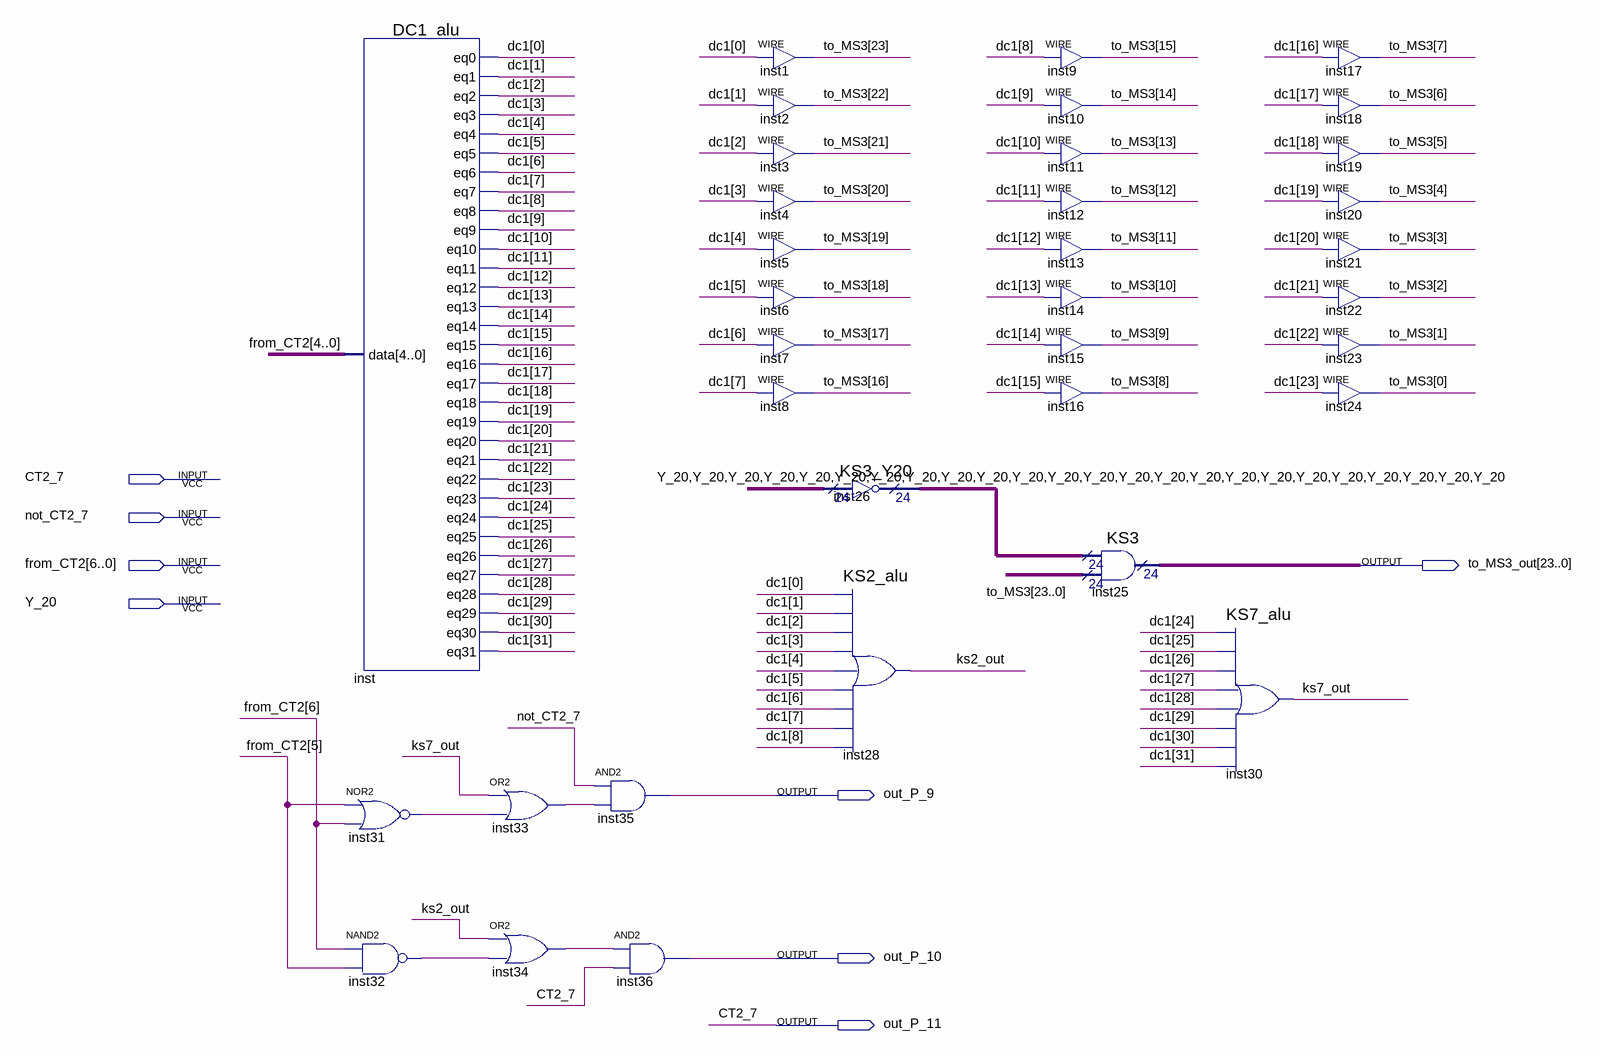
[diagram p0: schematic sheet]
// Quartus schematic DC1_KS2_KS3_KS7_block.bdf as structural Verilog: 35 symbols, 8 pins
module DC1_KS2_KS3_KS7_block (
  input  CT2_7,
  input  not_CT2_7,
  input  [6:0] from_CT2,
  input  Y_20,
  output [23:0] to_MS3_out,
  output out_P_9,
  output out_P_10,
  output out_P_11
);

  wire inst31_out, inst32_out, inst33_out, inst34_out, ks2_out, ks7_out;
  wire [23:0] inst26_result, to_MS3;
  wire [31:0] dc1;

  DC1_alu inst (
    .data(from_CT2[4:0]), .eq0(dc1[0]), .eq1(dc1[1]), .eq2(dc1[2]), .eq3(dc1[3]), .eq4(dc1[4]), .eq5(dc1[5]),
    .eq6(dc1[6]), .eq7(dc1[7]), .eq8(dc1[8]), .eq9(dc1[9]), .eq10(dc1[10]), .eq11(dc1[11]), .eq12(dc1[12]),
    .eq13(dc1[13]), .eq14(dc1[14]), .eq15(dc1[15]), .eq16(dc1[16]), .eq17(dc1[17]), .eq18(dc1[18]),
    .eq19(dc1[19]), .eq20(dc1[20]), .eq21(dc1[21]), .eq22(dc1[22]), .eq23(dc1[23]), .eq24(dc1[24]),
    .eq25(dc1[25]), .eq26(dc1[26]), .eq27(dc1[27]), .eq28(dc1[28]), .eq29(dc1[29]), .eq30(dc1[30]),
    .eq31(dc1[31]));
  nor inst31 (inst31_out, from_CT2[5], from_CT2[6]);
  nand inst32 (inst32_out, from_CT2[6], from_CT2[5]);
  or inst33 (inst33_out, ks7_out, inst31_out);
  or inst34 (inst34_out, ks2_out, inst32_out);
  and inst35 (out_P_9, not_CT2_7, inst33_out);
  and inst36 (out_P_10, inst34_out, CT2_7);
  assign to_MS3[23] = dc1[0];  // WIRE inst1
  assign to_MS3[22] = dc1[1];  // WIRE inst2
  assign to_MS3[21] = dc1[2];  // WIRE inst3
  assign to_MS3[20] = dc1[3];  // WIRE inst4
  assign to_MS3[19] = dc1[4];  // WIRE inst5
  assign to_MS3[18] = dc1[5];  // WIRE inst6
  assign to_MS3[17] = dc1[6];  // WIRE inst7
  assign to_MS3[16] = dc1[7];  // WIRE inst8
  KS3_Y20 inst26 (.data({24{Y_20}}), .result(inst26_result));
  KS2_alu inst28 (
    .data0(dc1[0]), .data1(dc1[1]), .data2(dc1[2]), .data3(dc1[3]), .data4(dc1[4]), .data5(dc1[5]),
    .data6(dc1[6]), .data7(dc1[7]), .data8(dc1[8]), .result(ks2_out));
  assign to_MS3[15] = dc1[8];  // WIRE inst9
  assign to_MS3[14] = dc1[9];  // WIRE inst10
  assign to_MS3[13] = dc1[10];  // WIRE inst11
  assign to_MS3[12] = dc1[11];  // WIRE inst12
  assign to_MS3[11] = dc1[12];  // WIRE inst13
  assign to_MS3[10] = dc1[13];  // WIRE inst14
  assign to_MS3[9] = dc1[14];  // WIRE inst15
  assign to_MS3[8] = dc1[15];  // WIRE inst16
  KS3 inst25 (.data0x(inst26_result), .data1x(to_MS3), .result(to_MS3_out));
  KS7_alu inst30 (
    .data0(dc1[24]), .data1(dc1[25]), .data2(dc1[26]), .data3(dc1[27]), .data4(dc1[28]), .data5(dc1[29]),
    .data6(dc1[30]), .data7(dc1[31]), .result(ks7_out));
  assign to_MS3[7] = dc1[16];  // WIRE inst17
  assign to_MS3[6] = dc1[17];  // WIRE inst18
  assign to_MS3[5] = dc1[18];  // WIRE inst19
  assign to_MS3[4] = dc1[19];  // WIRE inst20
  assign to_MS3[3] = dc1[20];  // WIRE inst21
  assign to_MS3[2] = dc1[21];  // WIRE inst22
  assign to_MS3[1] = dc1[22];  // WIRE inst23
  assign to_MS3[0] = dc1[23];  // WIRE inst24

  assign out_P_11 = CT2_7;
endmodule
